# EAGLE design Droid_meter_rev2 (EAGLE 6.1)
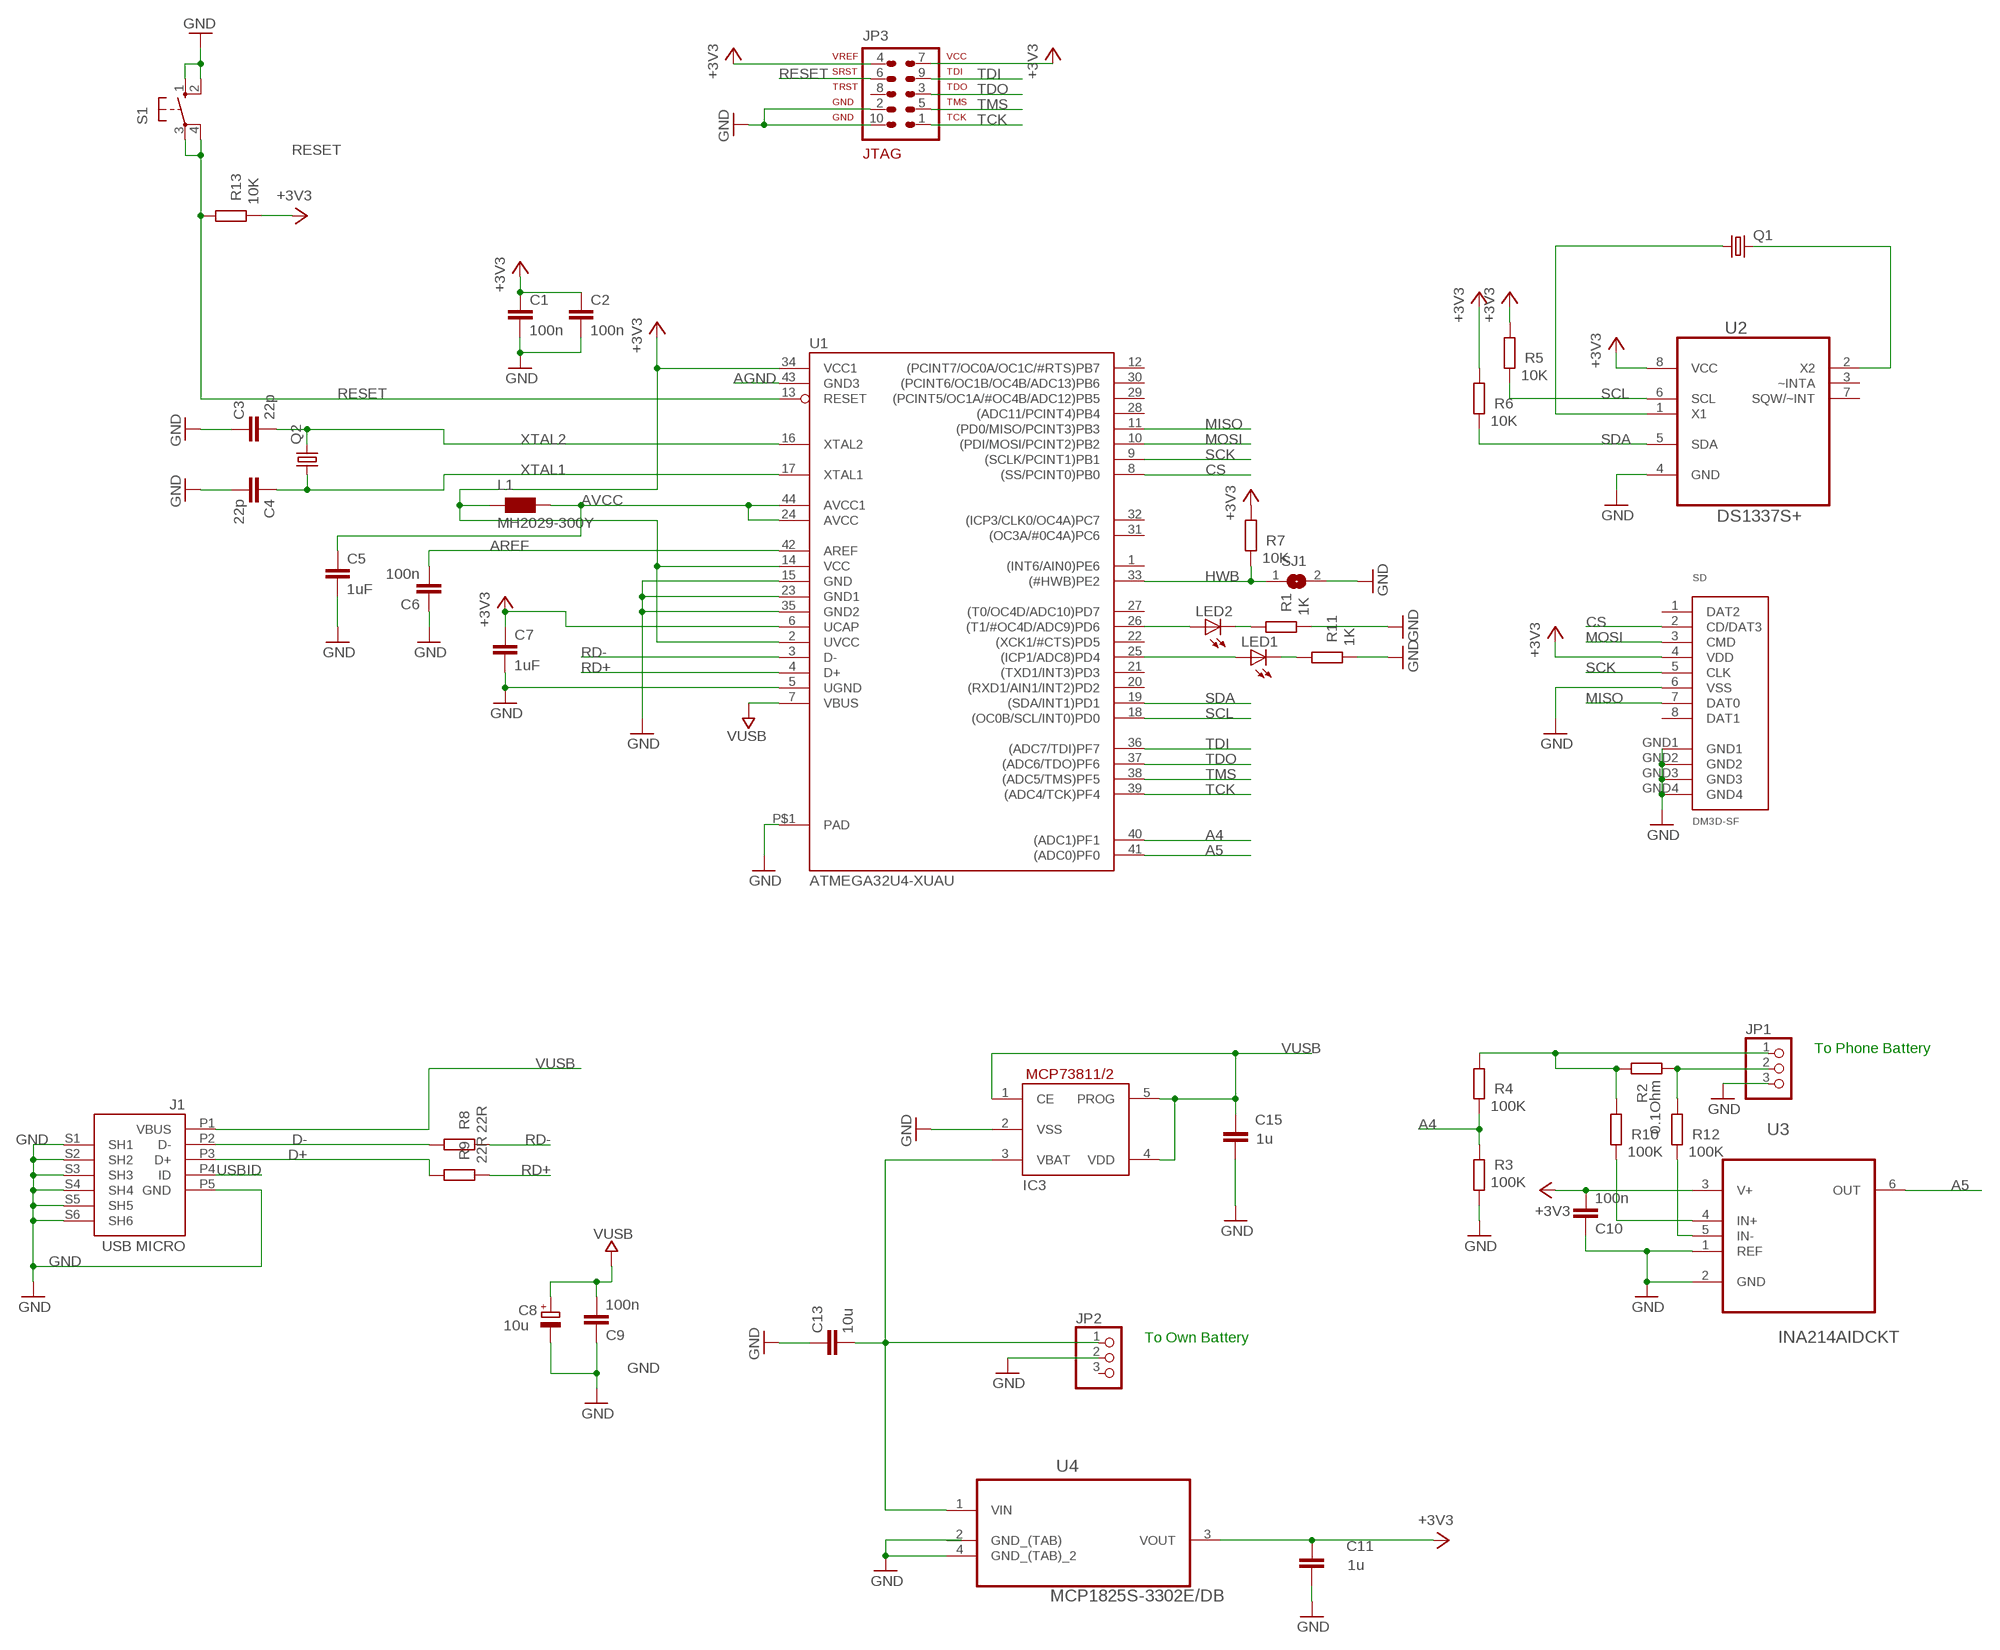
[diagram p0: schematic, sheet 1]

## Parts
C1  100n  C-EUC0603  [C0603-ROUND]
C2  100n  C-EUC0603  [C0603-ROUND]
C3  22p  C-EUC0603  [C0603-ROUND]
C4  22p  C-EUC0603  [C0603-ROUND]
C5  1uF  C-EUC0603  [C0603-ROUND]
C6  100n  C-EUC0603  [C0603-ROUND]
C7  1uF  C-EUC0603  [C0603-ROUND]
C8  10u  CPOL-EUSMCB  [SMC_B]
C9  100n  C-EUC0603  [C0603-ROUND]
C10  100n  C-EUC0603  [C0603-ROUND]
C11  1u  C-EUC0603  [C0603-ROUND]
C13  10u  C-EUC0805  [C0805]
C15  1u  C-EUC0603  [C0603-ROUND]
IC3  MCP73811/2  [SOT23-5L]
J1  USB MICRO  MYCON2_USB-MINI-B  [CON2_USB_MICRO_B_AT]
JP1  PINHD-1X3  [1X03]
JP2  PINHD-1X3  [1X03]
JP3  AVR-JTAG-10  [AVR-JTAG-10]
L1  MH2029-300Y  WE-CBF_0805  [0805]
LED1  LEDCHIP-LED0603  [CHIP-LED0603]
LED2  LEDCHIP-LED0603  [CHIP-LED0603]
Q1  CRYSTALMM39SL  [MM39SL]
Q2  CRYSTALCTS406  [CTS406]
R1  1K  R-EU_R0603  [R0603-ROUND]
R2  0.1Ohm  R-EU_R2512  [R2512]
R3  100K  R-EU_R0603  [R0603-ROUND]
R4  100K  R-EU_R0603  [R0603-ROUND]
R5  10K  R-EU_R0603  [R0603-ROUND]
R6  10K  R-EU_R0603  [R0603-ROUND]
R7  10K  R-EU_R0603  [R0603-ROUND]
R8  22R  R-EU_R0603  [R0603-ROUND]
R9  22R  R-EU_R0603  [R0603-ROUND]
R10  100K  R-EU_R0603  [R0603-ROUND]
R11  1K  R-EU_R0603  [R0603-ROUND]
R12  100K  R-EU_R0603  [R0603-ROUND]
R13  10K  R-EU_R0603  [R0603-ROUND]
S1  10-XX  [B3F-10XX]
SD  DM3D-SF  [DM3D-SF]
SJ1  SJ  [SJ]
U1  ATMEGA32U4-XUAU  [TQFP44-PAD]
U2  DS1337S+  [SOIC127P600X175-8N]
U3  INA214AIDCKT  [SOT65P210X110-6N]
U4  MCP1825S-3302E/DB  [SOT230P700X180-4N]

## Nets
+3V3: C1.1 C2.1 C7.1 C10.2 C11.2 JP3.4 JP3.7 L1.1 R5.1 R6.1 R7.1 R13.2 SD.4(VDD) U1.2(UVCC) U1.6(UCAP) U1.14(VCC) U1.34(VCC1) U2.8(VCC) U3.3(V+) U4.3(VOUT)
A4: R3.1 R4.2 U1.40((ADC1)PF1)
A5: U1.41((ADC0)PF0) U3.6(OUT)
AGND: U1.43(GND3)
AREF [aref]: C6.2 U1.42(AREF)
AVCC: C5.1 L1.2 U1.24(AVCC) U1.44(AVCC1)
CS: SD.2(CD/DAT3) U1.8((SS/PCINT0)PB0)
D+: J1.P3(D+) R9.1
D-: J1.P2(D-) R8.1
GND [gnd]: C1.2 C2.2 C3.1 C4.2 C5.2 C6.1 C7.2 C8.- C9.1 C10.1 C11.1 C13.1 C15.1 IC3.2(VSS) J1.P5(GND) J1.S1(SH1) J1.S2(SH2) J1.S3(SH3) J1.S4(SH4) J1.S5(SH5) J1.S6(SH6) JP1.3 JP2.2 JP3.2 JP3.10 R1.2 R3.2 R11.2 S1.1(S) S1.2(S1) SD.6(VSS) SD.GND1 SD.GND2 SD.GND3 SD.GND4 SJ1.2 U1.5(UGND) U1.15(GND) U1.23(GND1) U1.35(GND2) U1.P$1(PAD) U2.4(GND) U3.1(REF) U3.2(GND) U4.4(GND_(TAB)_2)
HWB: R7.2 SJ1.1 U1.33((#HWB)PE2)
MISO: SD.7(DAT0) U1.11((PD0/MISO/PCINT3)PB3)
MOSI: SD.3(CMD) U1.10((PDI/MOSI/PCINT2)PB2)
N$1: JP1.1 R2.2 R4.1 R10.1
N$2: JP1.2 R2.1 R12.1
N$3: Q1.4 U2.2(X2)
N$4: Q1.1 U2.1(X1)
N$5: C13.2 IC3.3(VBAT) JP2.1 U4.1(VIN)
N$6: R10.2 U3.4(IN+)
N$7: LED2.C R1.1
N$8: LED1.C R11.1
N$9: R12.2 U3.5(IN-)
N$55: LED1.A U1.25((ICP1/ADC8)PD4)
N$66: LED2.A U1.26((T1/#OC4D/ADC9)PD6)
RD+: R9.2 U1.4(D+)
RD-: R8.2 U1.3(D-)
RESET: JP3.6 R13.1 S1.3(P) S1.4(P1) U1.13(RESET)
SCK: SD.5(CLK) U1.9((SCLK/PCINT1)PB1)
SCL: R5.2 U1.18((OC0B/SCL/INT0)PD0) U2.6(SCL)
SDA: R6.2 U1.19((SDA/INT1)PD1) U2.5(SDA)
TCK: JP3.1 U1.39((ADC4/TCK)PF4)
TDI: JP3.9 U1.36((ADC7/TDI)PF7)
TDO: JP3.3 U1.37((ADC6/TDO)PF6)
TMS: JP3.5 U1.38((ADC5/TMS)PF5)
USBID: J1.P4(ID)
VUSB: C8.+ C9.2 C15.2 IC3.1(CE) IC3.4(VDD) IC3.5(PROG) J1.P1(VBUS) U1.7(VBUS)
XTAL1: C4.1 Q2.1 U1.17(XTAL1)
XTAL2: C3.2 Q2.3 U1.16(XTAL2)
Unconnected: JP2.3 JP3.8 SD.1(DAT2) SD.8(DAT1) U1.1((INT6/AIN0)PE6) U1.12((PCINT7/OC0A/OC1C/#RTS)PB7) U1.20((RXD1/AIN1/INT2)PD2) U1.21((TXD1/INT3)PD3) U1.22((XCK1/#CTS)PD5) U1.27((T0/OC4D/ADC10)PD7) U1.28((ADC11/PCINT4)PB4) U1.29((PCINT5/OC1A/#OC4B/ADC12)PB5) U1.30((PCINT6/OC1B/OC4B/ADC13)PB6) U1.31((OC3A/#0C4A)PC6) U1.32((ICP3/CLK0/OC4A)PC7) U2.3(~INTA) U2.7(SQW/~INT) U4.2(GND_(TAB))

## Notes on the sheet
- To Phone Battery
- To Own Battery

## Library data of the parts
C1-C7 C9-C11 C15 = SmartPrj:C-EU: CAPACITOR, European symbol
C8 = rcl:CPOL-EU: POLARIZED CAPACITOR, European symbol
C13 = rcl:C-EU: CAPACITOR, European symbol
IC3 = adafruit:MCP73811/2: MCP73811 and MCP73812 Simple, Miniature Single-Cell, Fully Integrated Li-Ion / Li-Polymer Charge Management Controllers SOT-23-5 package, no indicator LED but with adjustable current, small and very inexpensive
J1 = SmartPrj:MYCON2_USB-MINI-B
JP1 JP2 = pinhead:PINHD-1X3: PIN HEADER
JP3 = avr-7:AVR-JTAG-10: AVR JTAG Debug/Programming Header
L1 = wuerth-elektronik:WE-CBF: SMD EMI Suppression Ferrite Beads - excellent anti-EMI properties - low DCR - impedances till 3000 ohms - rated current up to 6 A
LED1 LED2 = led:LED: LED OSRAM: - CHIPLED LG R971, LG N971, LY N971, LG Q971, LY Q971, LO R971, LY R971 LH N974, LH R974 LS Q976, LO Q976, LY Q976 LO Q996 - Hyper CHIPLED LW Q18S LB Q993, LB Q99A, LB R99A - SideLED LS A670, LO A670, LY A670, LG A670, LP A670 LB A673, LV A673, LT A673, LW A673 LH A674 LY A675 LS A676, LA A676, LO A676, LY A676, LW A676 LS A679, LY A679, LG A679 - Hyper Micro SIDELED® LS Y876, LA Y876, LO Y876, LY Y876 LT Y87S - SmartLED LW L88C, LW L88S LB L89C, LB L89S, LG L890 LS L89K, LO L89K, LY L89K LS L896, LA L896, LO L896, LY L896 - TOPLED LS T670, LO T670, LY T670, LG T670, LP T670 LSG T670, LSP T670, LSY T670, LOP T670, LYG T670 LG T671, LOG T671, LSG T671 LB T673, LV T673, LT T673, LW T673 LH T674 LS T676, LA T676, LO T676, LY T676, LB T676, LH T676, LSB T676, LW T676 LB T67C, LV T67C, LT T67C, LS T67K, LO T67K, LY T67K, LW E67C LS E67B, LA E67B, LO E67B, LY E67B, LB E67C, LV E67C, LT E67C LW T67C LS T679, LY T679, LG T679 LS T770, LO T770, LY T770, LG T770, LP T770 LB T773, LV T773, LT T773, LW T773 LH T774 LS E675, LA E675, LY E675, LS T675 LS T776, LA T776, LO T776, LY T776, LB T776 LHGB T686 LT T68C, LB T68C - Hyper Mini TOPLED® LB M676 - Mini TOPLED Santana® LG M470 LS M47K, LO M47K, LY M47K Source: http://www.osram.convergy.de LUXEON: - LUMILED® LXK2-PW12-R00, LXK2-PW12-S00, LXK2-PW14-U00, LXK2-PW14-V00 LXK2-PM12-R00, LXK2-PM12-S00, LXK2-PM14-U00 LXK2-PE12-Q00, LXK2-PE12-R00, LXK2-PE12-S00, LXK2-PE14-T00, LXK2-PE14-U00 LXK2-PB12-K00, LXK2-PB12-L00, LXK2-PB12-M00, LXK2-PB14-N00, LXK2-PB14-P00, LXK2-PB14-Q00 LXK2-PR12-L00, LXK2-PR12-M00, LXK2-PR14-Q00, LXK2-PR14-R00 LXK2-PD12-Q00, LXK2-PD12-R00, LXK2-PD12-S00 LXK2-PH12-R00, LXK2-PH12-S00 LXK2-PL12-P00, LXK2-PL12-Q00, LXK2-PL12-R00 Source: www.luxeon.com KINGBRIGHT: KA-3528ASYC Source: www.kingbright.com
Q1 Q2 = crystal:CRYSTAL: CRYSTAL
R1-R13 = SmartPrj:R-EU_: RESISTOR, European symbol
S1 = switch-omron:10-XX: OMRON SWITCH
SD = phone_power_monitor:DM3D-SF
SJ1 = jumper:SJ: SMD solder JUMPER
U1 = SmartPrj:ATMEGA32U4-XU
U2 = dan:DS1337S+: 64 x 8, Serial, I2C Real-Time Clock; MPN: DS1337S+; OC_FARNELL: 1379748; OC_NEWARK: 08J6237; PACKAGE: SOIC-8; SUPPLIER: Maxim
U3 = dan:INA214AIDCKT: CURRENT SHUNT MONITOR; MPN: INA214AIDCKT; OC_FARNELL: 1754262; OC_NEWARK: 05N1041; PACKAGE: SC-70-6; SUPPLIER: Texas Instruments
U4 = dan:MCP1825S-3302E/DB: IC, LDO VOLT REG, 3.3V, 0.5A; MPN: MCP1825S-3302E/DB; OC_FARNELL: 1578404; OC_NEWARK: 26M9961; PACKAGE: SOT-223-3; SUPPLIER: Microchip

## Net classes
0 default: width 0.254 mm, drill 0.61 mm, clearance 0.254 mm
1 power: width 0.254 mm, drill 0.61 mm, clearance 0.254 mm
2 gnd: width 0.254 mm, drill 0.61 mm, clearance 0.254 mm
3 usbvcc: width 0.254 mm, drill 0.61 mm, clearance 0.254 mm
4 aref: width 0.254 mm, drill 0.61 mm, clearance 0.254 mm

## Board
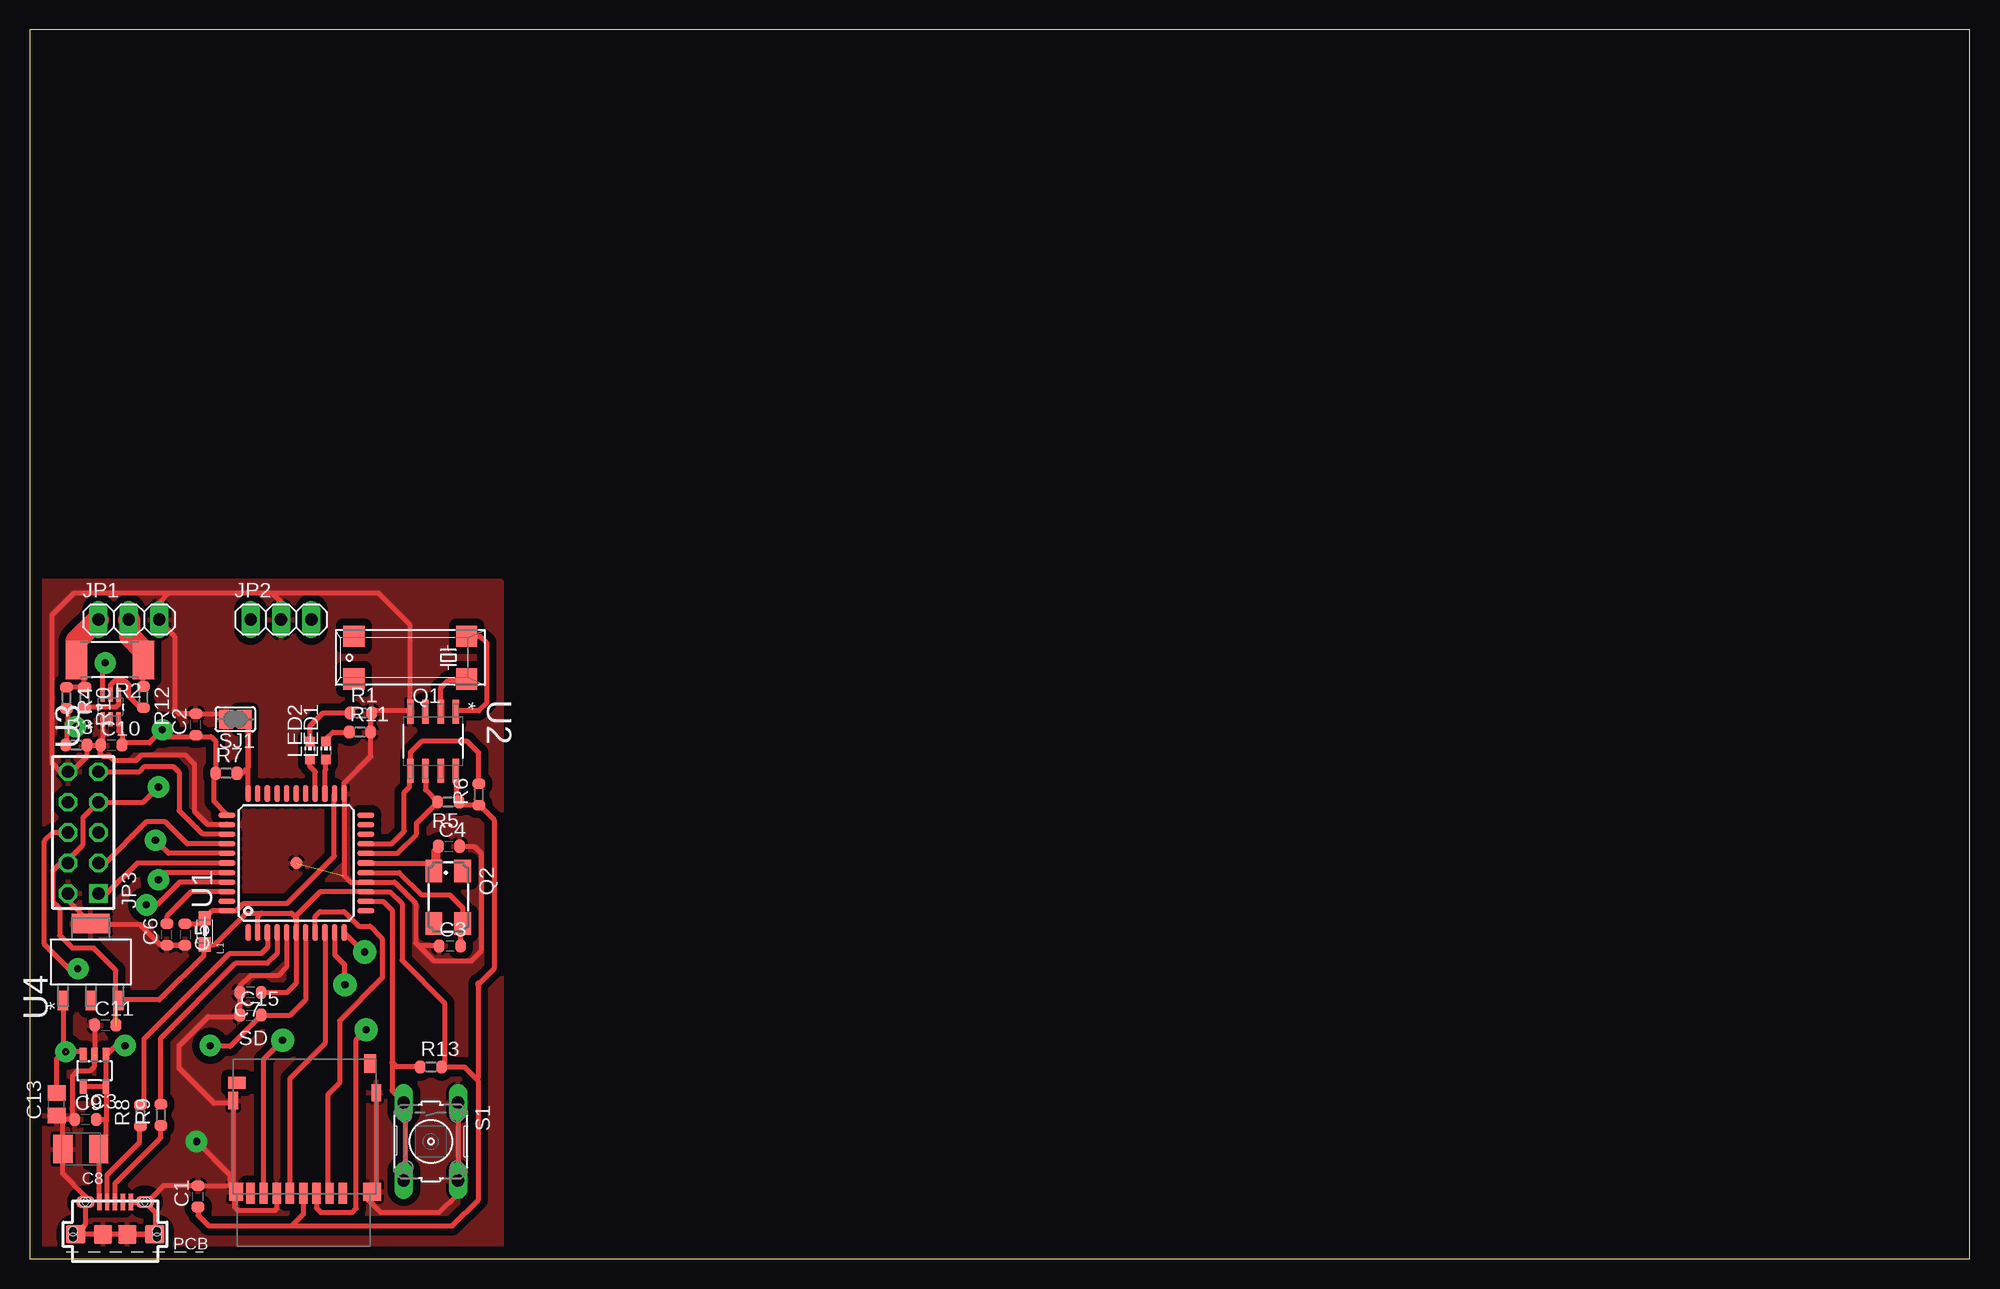
[diagram p1: board, top side]
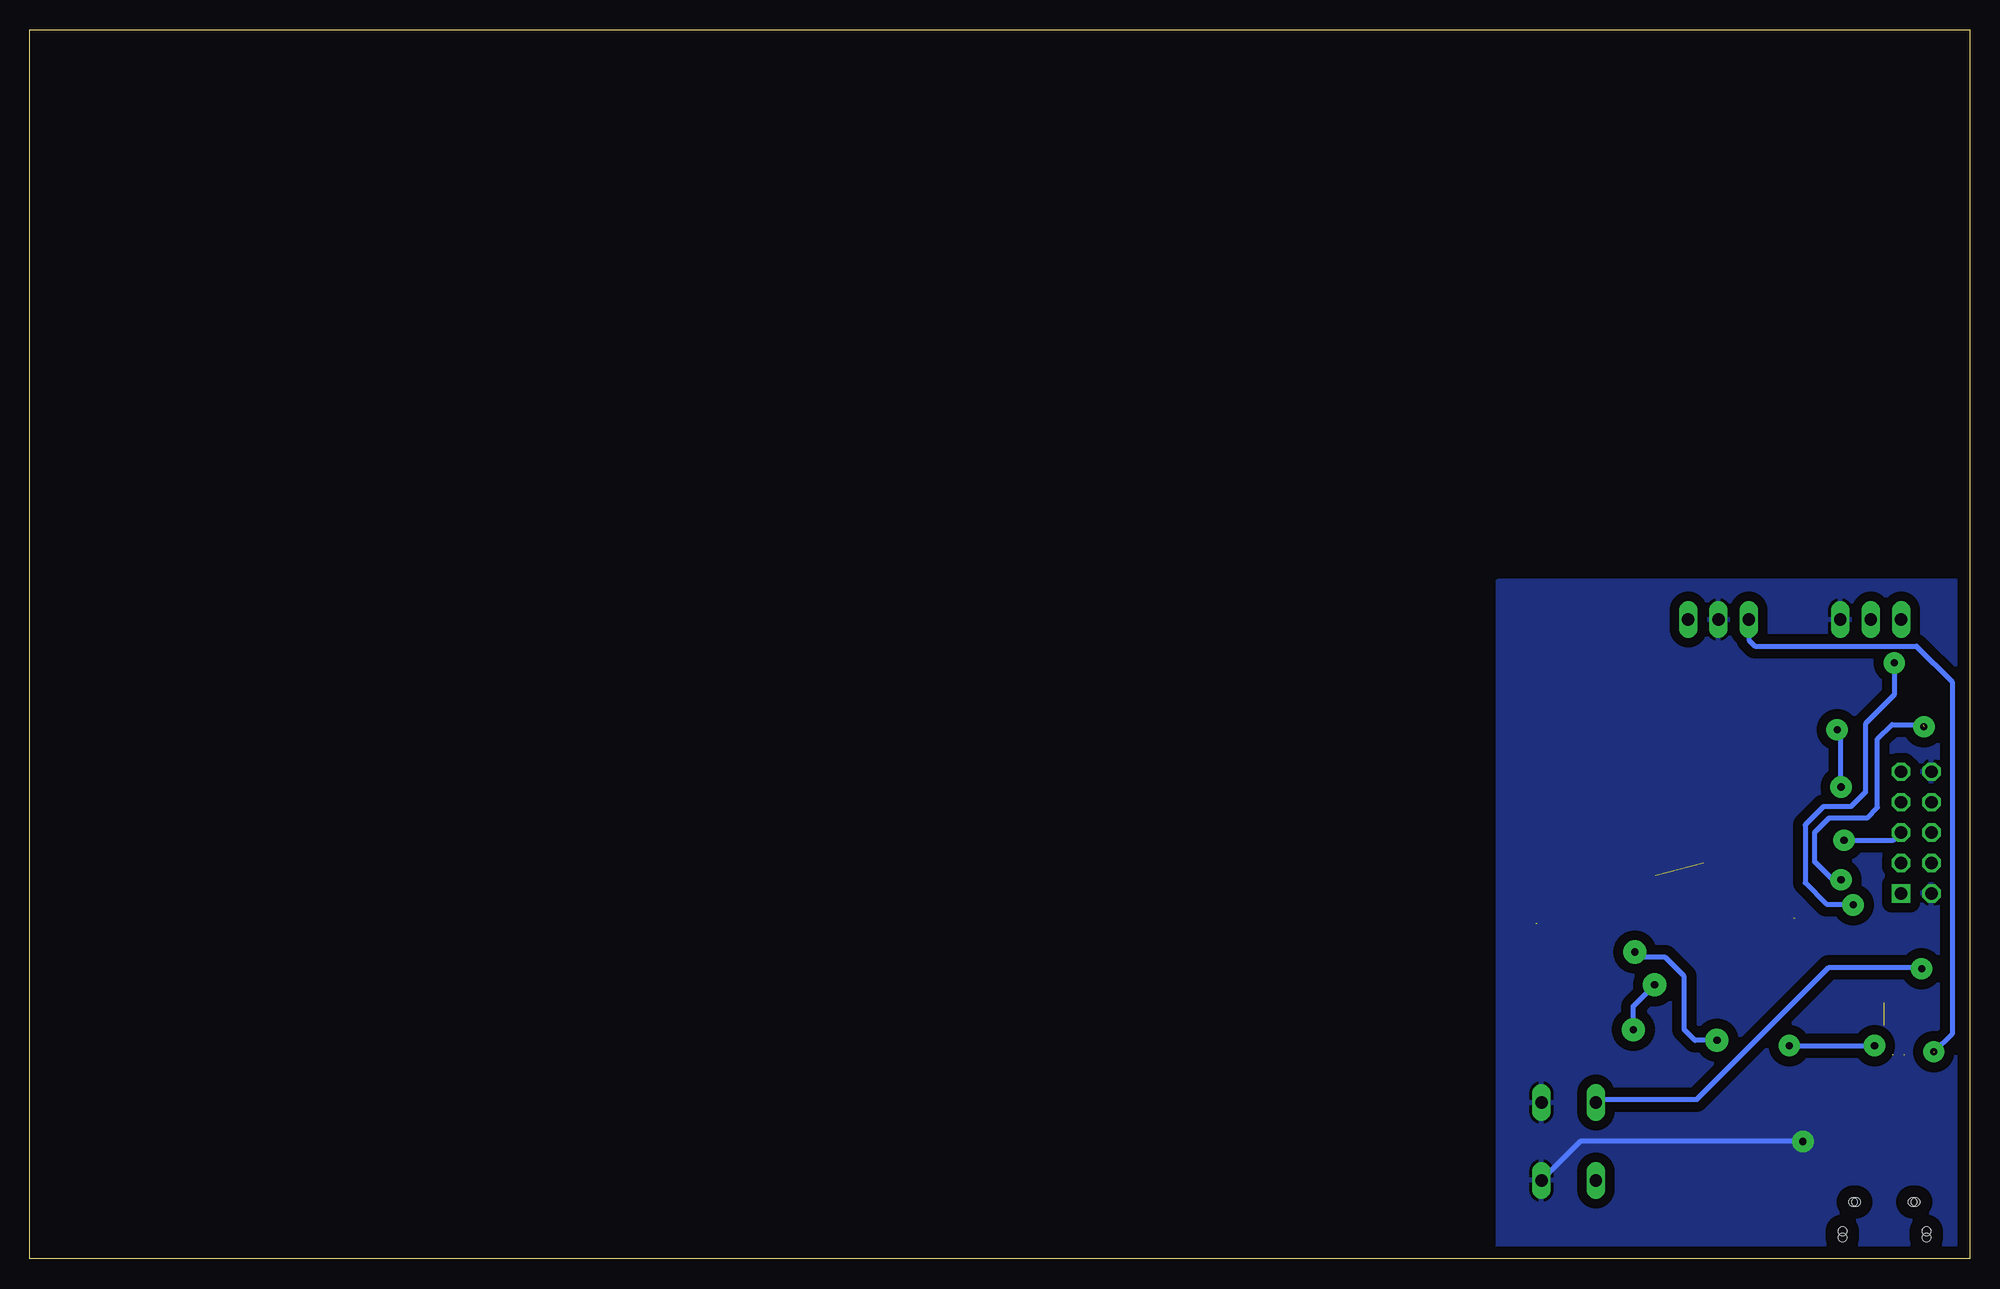
[diagram p2: board, bottom side, seen from below]

Size 161.91 x 102.54 mm. Coordinates in mm from the lower left corner, seen from the top.
Outline: 0,0 161.91,0 161.91,102.54 0,102.54 0,0
Copper layers (1*16): Top 0.035mm / dielectric 1.5mm / Bottom 0.035mm
Design rules: minimum track width 10mil, minimum drill 24mil, track to track 8mil, track to pad 8mil, pad to pad 8mil, via to via 8mil, smd to smd 8mil, copper to edge 40mil, drill to drill 8mil, minimum pad ring 10mil, minimum via ring 8mil, stop-mask expansion 4mil, vias tented up to drill 0mil, thermal gap 10mil

### Footprints (pad centres in the part's own frame; a part is rotated, then mirrored left to right if it is on the bottom)
C0603-ROUND = smd 0.898 x 1.1: 1 -0.889,0; 2 0.889,0
SMC_B = smd 1.6 x 2.4: + -1.5,0; - 1.5,0
C0805 = smd 1.3 x 1.5: 1 -0.95,0; 2 0.95,0
SOT23-5L = smd 0.55 x 1.2: 1 -0.95,-1.3; 2 0,-1.3; 3 0.95,-1.3; 4 0.95,1.3; 5 -0.95,1.3
CON2_USB_MICRO_B_AT = smd 0.406 x 1.346: P1 -1.321,2.692; P2 -0.66,2.692; P3 0,2.692; P4 0.66,2.692; P5 1.321,2.692 | smd 1.651 x 1.549: S1 -3.302,0; S2 3.302,0 | smd 1.524 x 1.016: S3 -2.489,2.692; S4 2.489,2.692 | smd 1.524 x 1.524: S5 -1.016,0; S6 1.016,0 | hole 0.7: -3.505,0.254; -3.505,-0.254; 3.505,0.254; 3.505,-0.254; -2.616,2.692; -2.362,2.692; 2.362,2.692; 2.616,2.692
1X03 = drill 1.016 long: 1 -2.54,0; 2 0,0; 3 2.54,0
AVR-JTAG-10 = drill 1.016 square: 1 -5.08,-1.27 | drill 1.016 octagon: 2 -5.08,1.27; 3 -2.54,-1.27; 4 -2.54,1.27; 5 0,-1.27; 6 0,1.27; 7 2.54,-1.27; 8 2.54,1.27; 9 5.08,-1.27; 10 5.08,1.27
0805 = smd 1.2 x 1: 1 -1.1,0; 2 1.1,0
CHIP-LED0603 = smd 0.8 x 0.8: A 0,-0.75; C 0,0.75
MM39SL = smd 1.778 x 1.778: 1 -4.699,-1.778; 2 4.699,-1.778; 3 4.699,1.778; 4 -4.699,1.778
CTS406 = smd 1.9 x 1.4: 1 -2.2,-1.2; 2 2.2,-1.2; 3 2.2,1.2; 4 -2.2,1.2
R0603-ROUND = smd 0.898 x 1.1: 1 -0.889,0; 2 0.889,0
R2512 = smd 1.8 x 3.2: 1 -2.8,0; 2 2.8,0
B3F-10XX = drill 1.016 long: 1 -3.251,2.261; 2 3.251,2.261; 3 -3.251,-2.261; 4 3.251,-2.261
DM3D-SF = smd 0.7 x 1.75: 1 7.7,-0.875; 2 6.6,-0.875; 3 5.5,-0.875; 4 4.4,-0.875; 5 3.3,-0.875; 6 2.2,-0.875; 7 1.1,-0.875; 8 0,-0.875 | smd 0.8 x 1.5: GND1 -1.45,6.85 | smd 0.8 x 1.4: GND2 10.5,7.5 | smd 1.5 x 1.5: GND3 10.15,-0.75 | smd 1.2 x 1.5: GND4 -1.2,-0.75 | smd 1 x 1.55: P$4 10,9.925 | smd 1.45 x 1: P$5 -1.125,8.35
SJ = smd 1.168 x 1.6: 1 -0.762,0; 2 0.762,0
TQFP44-PAD = smd 1.4 x 0.45: 1 -5.8,4; 2 -5.8,3.2; 3 -5.8,2.4; 4 -5.8,1.6; 5 -5.8,0.8; 6 -5.8,0; 7 -5.8,-0.8; 8 -5.8,-1.6; 9 -5.8,-2.4; 10 -5.8,-3.2; 11 -5.8,-4; 23 5.8,-4; 24 5.8,-3.2; 25 5.8,-2.4; 26 5.8,-1.6; 27 5.8,-0.8; 28 5.8,0; 29 5.8,0.8; 30 5.8,1.6; 31 5.8,2.4; 32 5.8,3.2; 33 5.8,4 | smd 0.45 x 1.4: 12 -4,-5.8; 13 -3.2,-5.8; 14 -2.4,-5.8; 15 -1.6,-5.8; 16 -0.8,-5.8; 17 0,-5.8; 18 0.8,-5.8; 19 1.6,-5.8; 20 2.4,-5.8; 21 3.2,-5.8; 22 4,-5.8; 34 4,5.8; 35 3.2,5.8; 36 2.4,5.8; 37 1.6,5.8; 38 0.8,5.8; 39 0,5.8; 40 -0.8,5.8; 41 -1.6,5.8; 42 -2.4,5.8; 43 -3.2,5.8; 44 -4,5.8 | smd 1 x 1: P$1 0,0
SOIC127P600X175-8N = smd 1.981 x 0.533: 1 -2.464,1.905; 2 -2.464,0.635; 3 -2.464,-0.635; 4 -2.464,-1.905; 5 2.464,-1.905; 6 2.464,-0.635; 7 2.464,0.635; 8 2.464,1.905
SOT65P210X110-6N = smd 1.168 x 0.356: 1 -1.041,0.66; 2 -1.041,0; 3 -1.041,-0.66; 4 1.041,-0.66; 5 1.041,0; 6 1.041,0.66
SOT230P700X180-4N = smd 1.626 x 0.889: 1 -3.2,2.311; 2 -3.2,0; 3 -3.2,-2.311 | smd 1.626 x 3.175: 4 3.2,0

### Placement (x,y rotation side)
C1  14.03,5.21 90 top
C2  13.84,44.58 90 top
C3  35.05,26.1 0 top
C4  34.99,34.42 0 top
C5  12.95,27.05 270 top
C6  11.43,27.05 90 top
C7  18.42,22.22 180 top
C8  4.25,9.14 180 top
C9  4.64,11.62 0 top
C10  6.79,42.86 0 top
C11  6.29,19.49 0 top
C13  2.22,12.89 90 top
C15  18.42,20.32 0 top
IC3  5.4,15.68 180 top
J1  7.11,2.03 0 top
JP1  8.25,53.34 0 top
JP2  20.96,53.34 0 top
JP3  4.45,35.56 90 top
L1  14.6,27.3 90 top
LED1  24.7,42.42 0 top
LED2  23.37,42.42 0 top
Q1  31.75,50.16 180 top
Q2  34.93,30.16 270 top
R1  27.62,45.53 0 top
R2  6.67,49.97 180 top
R3  3.87,42.86 0 top
R4  3.05,46.8 270 top
R5  34.93,38.1 180 top
R6  37.47,38.73 90 top
R7  16.38,40.51 0 top
R8  9.21,11.94 90 top
R9  10.92,12 90 top
R10  4.57,46.8 270 top
R11  27.56,43.94 0 top
R12  9.46,46.86 270 top
R13  33.46,16 0 top
S1  33.46,9.78 270 top
SD  18.42,6.35 0 top
SJ1  17.14,45.02 180 top
U1  22.23,33.02 90 top
U2  33.66,43.18 270 top
U3  6.73,46.04 90 top
U4  5.08,24.77 90 top

### Tracks (layer width: path | path; a pad name or v marks a point on that pad's centre or on a via)
+3V3  (via drill 0.6 pad 1.78)  (1 unrouted)
  Top 0.406: U2.8 35.56,38.35 R5.1 36.07,37.85 R6.1 37.53,37.85 38.73,36.64 38.73,24.19 37.4,22.86 | 37.31,14.95 36.26,16 R13.2 34.61,16.26 34.61,21.34 31.05,24.89 31.05,29.65 30.09,30.62 U1.14 24.21,30.62 22.23,28.64 22.23,28.45 | 37.31,14.95 37.4,14.86 37.4,4.89 35.24,2.73 21.84,2.73 | 22.86,5.43 SD.4 22.82,3.7 21.84,2.73 | C1.1 14.03,3.62 14.92,2.73 21.84,2.73 | 19.3,28.83 18.03,28.83 15.41,26.2 L1.1 14.54,26.14 14.54,25.34 10.79,21.59 7.42,21.59 U4.3 | 19.3,28.83 21.84,28.83 22.23,28.45 | 22.23,28.45 U1.6 22.23,22.99 21.46,22.22 C7.1 | U1.2 19.03,28.55 19.3,28.83 | U4.3 7.39,21.74 | 37.4,22.99 37.4,22.86 | 37.4,22.86 37.4,15.05 37.31,14.95 | 22.23,28.45 22.16,28.38 | 13.72,43.56 11.05,43.56 v11.05,44.13 9.97,43.05 7.68,43.05 7.62,42.99 7.68,42.93 C10.2 7.68,43.75 7.39,44.04 U3.3 | 13.72,43.56 C2.1 13.91,43.75 | U1.34 16.43,37.11 15.37,38.16 15.37,40.45 R7.1 15.49,43.18 15.11,43.56 13.72,43.56 | 7.18,21.35 U4.3 | C11.2 7.18,24.07 5.33,25.91 3.56,25.91 2.48,26.99 2.48,29.27 1.91,29.84 1.91,32.38 2.54,33.02 JP3.4 3.17,33.27 4.45,34.54 4.45,36.83 JP3.7 9.46,38.1 v10.73,39.37
  Bottom 0.406: v10.73,39.37 10.73,43.81 v11.05,44.13
A4  (via drill 0.6 pad 1.78)  (1 unrouted)
  Top 0.406: U1.40 11.33,32.22 v10.73,31.62 | v3.81,44.39 3.17,44.7 | 3.17,44.7 3.11,44.7 | 3.17,44.7 3.11,44.64 3.11,42.99 R3.1 | 3.17,44.7 3.17,45.91 3.05,46.04 R4.2
  Bottom 0.406: v10.73,31.62 11.43,31.62 12.95,33.15 12.95,35.56 11.75,36.77 8.57,36.77 7.68,37.66 7.68,43.37 6.48,44.58 3.87,44.58
A5  (via drill 0.6 pad 1.78)
  Top 0.406: U1.41 12.5,31.42 10.6,29.53 v9.72,29.53 | U3.6 6.07,49.51 v6.29,49.72
  Bottom 0.406: v9.72,29.53 9.65,29.53 9.72,29.59 11.94,29.59 13.72,31.37 13.72,36.2 12.19,37.72 9.91,37.72 8.7,38.93 8.7,44.64 6.29,47.05 v6.29,49.72
AREF
  Top 0.406: U1.42 13.47,30.62 11.43,28.57 C6.2
AVCC  (1 unrouted)
  Top 0.406: L1.2 15.22,29.02 U1.44 17.21,29.02 17.84,29.65 21.46,29.65 25.4,33.59 25.4,38.8 U1.24 | C5.1 14.16,27.94 14.67,28.45
CS
  Top 0.406: SD.2 24.89,5.6 24.89,13.72 25.84,14.67 25.84,19.88 29.4,23.43 29.4,26.67 29.34,26.73 29.34,26.8 28.39,27.75 27.43,27.75 26.23,28.96 24.19,28.96 23.83,28.59 U1.8
D+
  Top 0.406: J1.P3 7.11,6.29 10.92,10.1 R9.1
D-
  Top 0.406: J1.P2 6.45,7.02 9.14,9.72 9.14,10.98 R8.1
GND  (via drill 0.6 pad 1.78)  (2 unrouted)
  Top 0.406: JP1.3 10.79,53.09 | 10.73,53.09 10.73,53.28 | 10.73,53.28 10.73,54.67 11.62,55.56 | 11.62,55.56 20.19,55.56 | 20.19,55.56 20.89,54.86 | 20.89,54.86 20.89,53.4 JP2.2 | 16.46,36.26 U1.35 16.39,36.26 14.79,36.26 13.72,37.34 13.72,41.27 12.95,42.04 9.33,42.04 8.89,41.59 6.99,41.59 6.67,41.91 6.1,41.91 5.84,42.16 5.84,42.42 5.91,42.48 C10.1 | 28.26,4.89 28.26,5.29 SD.GND3 28.92,5.95 SD.GND2 | 16.72,6.1 C1.2 11.15,6.1 9.78,4.72 J1.S4 | 16.72,6.1 16.84,5.98 | 16.84,5.98 SD.GND4 17.08,5.47 17.08,4.32 17.4,4 20.45,4 20.62,4.17 SD.6 | J1.S2 J1.S6 | J1.S6 J1.S5 J1.S1 4.62,2.85 J1.S3 4.62,5.22 2.73,7.11 2.73,9.12 C8.- | U1.5 21.43,24.35 20.7,23.62 18.42,23.62 17.53,22.73 C7.2 C15.1 17.46,20.32 17.34,20.19 14.86,20.19 12.45,17.78 12.45,15.88 15.37,12.95 16.72,12.95 | 16.72,12.95 SD.GND1 | 28.26,4.89 28.26,4.83 | 20.96,54.8 20.89,54.86 | 20.19,55.56 29.08,55.56 31.69,52.96 31.69,45.71 | 31.69,45.71 U2.4 | 28.26,4.89 29.27,3.87 34.16,3.87 35.69,5.4 35.69,6.6 | J1.P5 J1.S4 | J1.S6 10.03,2.03 10.48,2.48 10.48,3.85 J1.S4 | 35.69,6.6 35.69,6.67 | S1.1 35.73,6.64 35.69,6.6 | 16.72,6.1 16.72,6.97 v13.91,9.78 | 16.72,12.95 16.96,12.95 16.96,6.1 16.84,5.98 | C8.- 2.75,11.52 C13.1 | C8.- 2.75,11.62 | 2.75,11.62 2.75,11.96 | IC3.2 5.4,16.07 5.02,15.68 4,15.68 3.56,15.24 3.56,11.94 3.75,11.75 | 10.73,53.28 12.06,51.94 12.06,45.85 12.45,45.47 C2.2 15.94,45.47 SJ1.2 | 2.75,11.62 C9.1 3.75,11.75 | 3.75,11.75 3.81,11.68 | C10.1 R3.2 4.76,41.91 3.49,40.64 JP3.10 2.54,40.64 1.84,41.34 1.84,53.72 3.68,55.56 11.62,55.56 | U3.2 U3.1 6.07,43.22 C10.1 | JP3.2 3.17,29.87 U4.4 5.17,27.88 9.21,27.88 10.92,26.16 C5.2 C6.1
  Top 0.406: 5.46,16.95 5.46,17.02 5.4,17.08 C11.1 5.08,19.81 | 31.69,45.71 28.69,45.71 R1.2 28.45,45.47 R11.2 28.45,41.91 26.23,39.69 U1.23 26.23,31.94 26.73,31.43 28.01,31.43 U1.15 30.43,31.42 32.2,29.65 32.2,26.35 32.45,26.1 | C3.1 32.45,26.1 | C4.2 37.08,34.42 37.66,33.84 37.66,25.65 36.83,24.83 33.72,24.83 32.45,26.1 | 5.84,43.12 C10.1
  Bottom 0.406: v13.91,9.78 32.47,9.78 S1.2
  pour Bottom (isolate 0.813): 0,56.52 39.37,56.52 39.37,0 0,0
  pour Top (isolate 0.61): 0,0 39.37,0 39.37,56.52 0,56.52
HWB
  Top 0.406: U1.33 18.23,44.64 | 18.23,44.64 18.23,44.7 SJ1.1 | R7.2 17.72,40.51 18.23,41.02 18.23,44.64 | 18.23,44.64
MISO  (via drill 0.6 pad 1.93)
  Top 0.406: SD.7 19.52,16.66 v21.08,18.22 | v27.94,25.59 27.86,25.59 U1.11
  Bottom 0.406: v21.08,18.22 22.92,18.22 23.81,19.11 23.81,23.56 25.4,25.15 27.56,25.15 28,25.59 v27.94,25.59 27.81,25.46
MOSI  (via drill 0.6 pad 1.93)
  Top 0.406: SD.3 23.92,4.21 24.26,3.87 26.92,3.87 27.24,4.19 27.24,18.29 v28.07,19.11 | v26.29,22.86 26.29,24.51 25.46,25.34 25.46,27.18 U1.10
  Bottom 0.406: v28.07,19.11 28.07,21.08 v26.29,22.86
N$1
  Top 0.406: R4.1 R10.1 4.51,47.62 4.51,49.02 3.87,49.66 R2.2
  Top 1.778: JP1.1 5.65,53.34 3.87,51.56 3.87,49.98 R2.2
N$2
  Top 0.406: R12.1 R2.1
  Top 1.778: R2.1 9.47,50.79 8.32,51.94 8.32,53.28 JP1.2
N$3
  Top 0.406: U2.2 34.29,47.62 34.93,48.26 36.2,48.26 36.32,48.39 Q1.4
N$4
  Top 0.406: Q1.1 37.59,51.94 38.1,51.44 38.1,46.35 37.47,45.72 35.64,45.72 U2.1
N$5  (via drill 0.6 pad 1.78)  (1 unrouted)
  Top 0.406: 2.86,21.48 U4.1 2.77,17.29 2.79,17.27 | IC3.3 4.45,17.27 v2.98,17.27 2.79,17.27 | C13.2 2.22,16.7 2.79,17.27
  Bottom 0.406: 2.86,17.4 v2.98,17.27 | 2.92,17.21 2.98,17.21 1.46,18.73 1.46,48.13 4.45,51.12 17.91,51.12 18.42,51.63 JP2.1
N$6
  Top 0.406: U3.4 7.39,46.25 7.18,46.04 4.83,46.04 R10.2
N$7
  Top 0.406: R1.1 24.45,45.53 23.37,44.45 LED2.C
N$8
  Top 0.406: LED1.C 24.7,43.37 25.27,43.94 R11.1
N$9
  Top 0.406: U3.5 6.73,47.88 7.11,48.26 7.87,48.26 8.25,47.88 8.25,46.93 9.08,46.1 R12.2
N$55
  Top 0.406: U1.25 24.62,40.75 24.7,40.83 LED1.A
N$66
  Top 0.406: U1.26 23.83,40.63 23.37,41.08 LED2.A
RD+
  Top 0.406: U1.4 20.62,25.45 19.81,24.64 17.14,24.64 10.92,18.41 R9.2
RD-
  Top 0.406: U1.3 19.83,25.98 19.3,25.46 16.64,25.46 9.53,18.35 9.53,12.89 9.46,12.83 R8.2
RESET  (via drill 0.6 pad 1.78)
  Top 0.406: U1.13 29.49,29.82 30.23,29.08 30.23,16.38 | 30.23,16.38 30.23,14.03 31.23,13.03 | 31.23,13.03 31.31,12.95 31.31,6.86 31.12,6.67 31.24,6.67 31.24,6.57 S1.4 | R13.1 30.61,16 30.23,16.38 | S1.3 31.23,13.03 | v4,24.19 3.24,24.19 1.21,26.23 1.21,34.86 1.91,35.56 JP3.6
  Bottom 0.406: S1.3 30.96,13.27 22.8,13.27 11.75,24.32 4.13,24.32 v4,24.19
SCK
  Top 0.406: SD.5 21.71,15.05 24.62,17.96 U1.9
SCL
  Top 0.406: U1.18 30.64,33.82 32.26,35.43 32.26,36.32 R5.2 33.02,39.12 U2.6
SDA
  Top 0.406: R6.2 37.47,42.23 36.51,43.18 32.7,43.18 31.75,42.23 U2.5 31.69,40.65 31.69,39.37 31.24,38.93 31.24,35.69 30.18,34.62 U1.19
TCK
  Top 0.406: U1.39 8.95,33.02 6.41,30.48 JP3.1
TDI
  Top 0.406: U1.36 14.43,35.42 12.45,37.4 12.45,40.58 11.94,41.08 9.59,41.08 9.14,40.64 JP3.9
TDO
  Top 0.406: U1.37 13.13,34.62 11.3,36.45 9.72,36.45 6.22,32.96 5.78,32.96 JP3.3
TMS  (via drill 0.6 pad 1.78)
  Top 0.406: U1.38 11.58,33.82 v10.48,34.92
  Bottom 0.406: v10.48,34.92 6.35,34.92 JP3.5
VUSB  (via drill 0.6 pad 1.78)  (1 unrouted)
  Top 0.406: U1.7 23.03,21.63 21.72,20.32 C15.2 16.7,17.72 15.11,17.72 v15.05,17.78 | IC3.5 IC3.1 | IC3.4 IC3.5 | IC3.5 6.35,11.43 | J1.P1 5.79,9.11 C8.+ 6.35,9.74 6.35,11.43 | C9.2 6.16,11.62 | 6.16,11.62 6.29,11.62 | 6.35,11.43 6.16,11.62 | v7.94,17.78 7.18,17.78 6.41,17.02
  Bottom 0.406: v15.05,17.78 v7.94,17.78
XTAL1
  Top 0.406: U1.17 33.53,33.02 33.91,32.64 | 33.91,32.64 33.91,32.45 | 33.91,32.64 33.91,34.35 34.04,34.35 | Q2.1 33.73,32.89 | 33.73,32.89 33.73,34.04 34.04,34.35 | 34.04,34.35 C4.1 | 34.04,34.35 34.04,33.2 33.73,32.89
XTAL2  (1 unrouted)
  Top 0.406: U1.16 30.84,32.22 32.7,30.35 35.05,30.35 36.13,29.27 Q2.3 | C3.2 35.94,27.69 36.2,27.94